# Altium project WS2812RGB_Project.PrjPcb
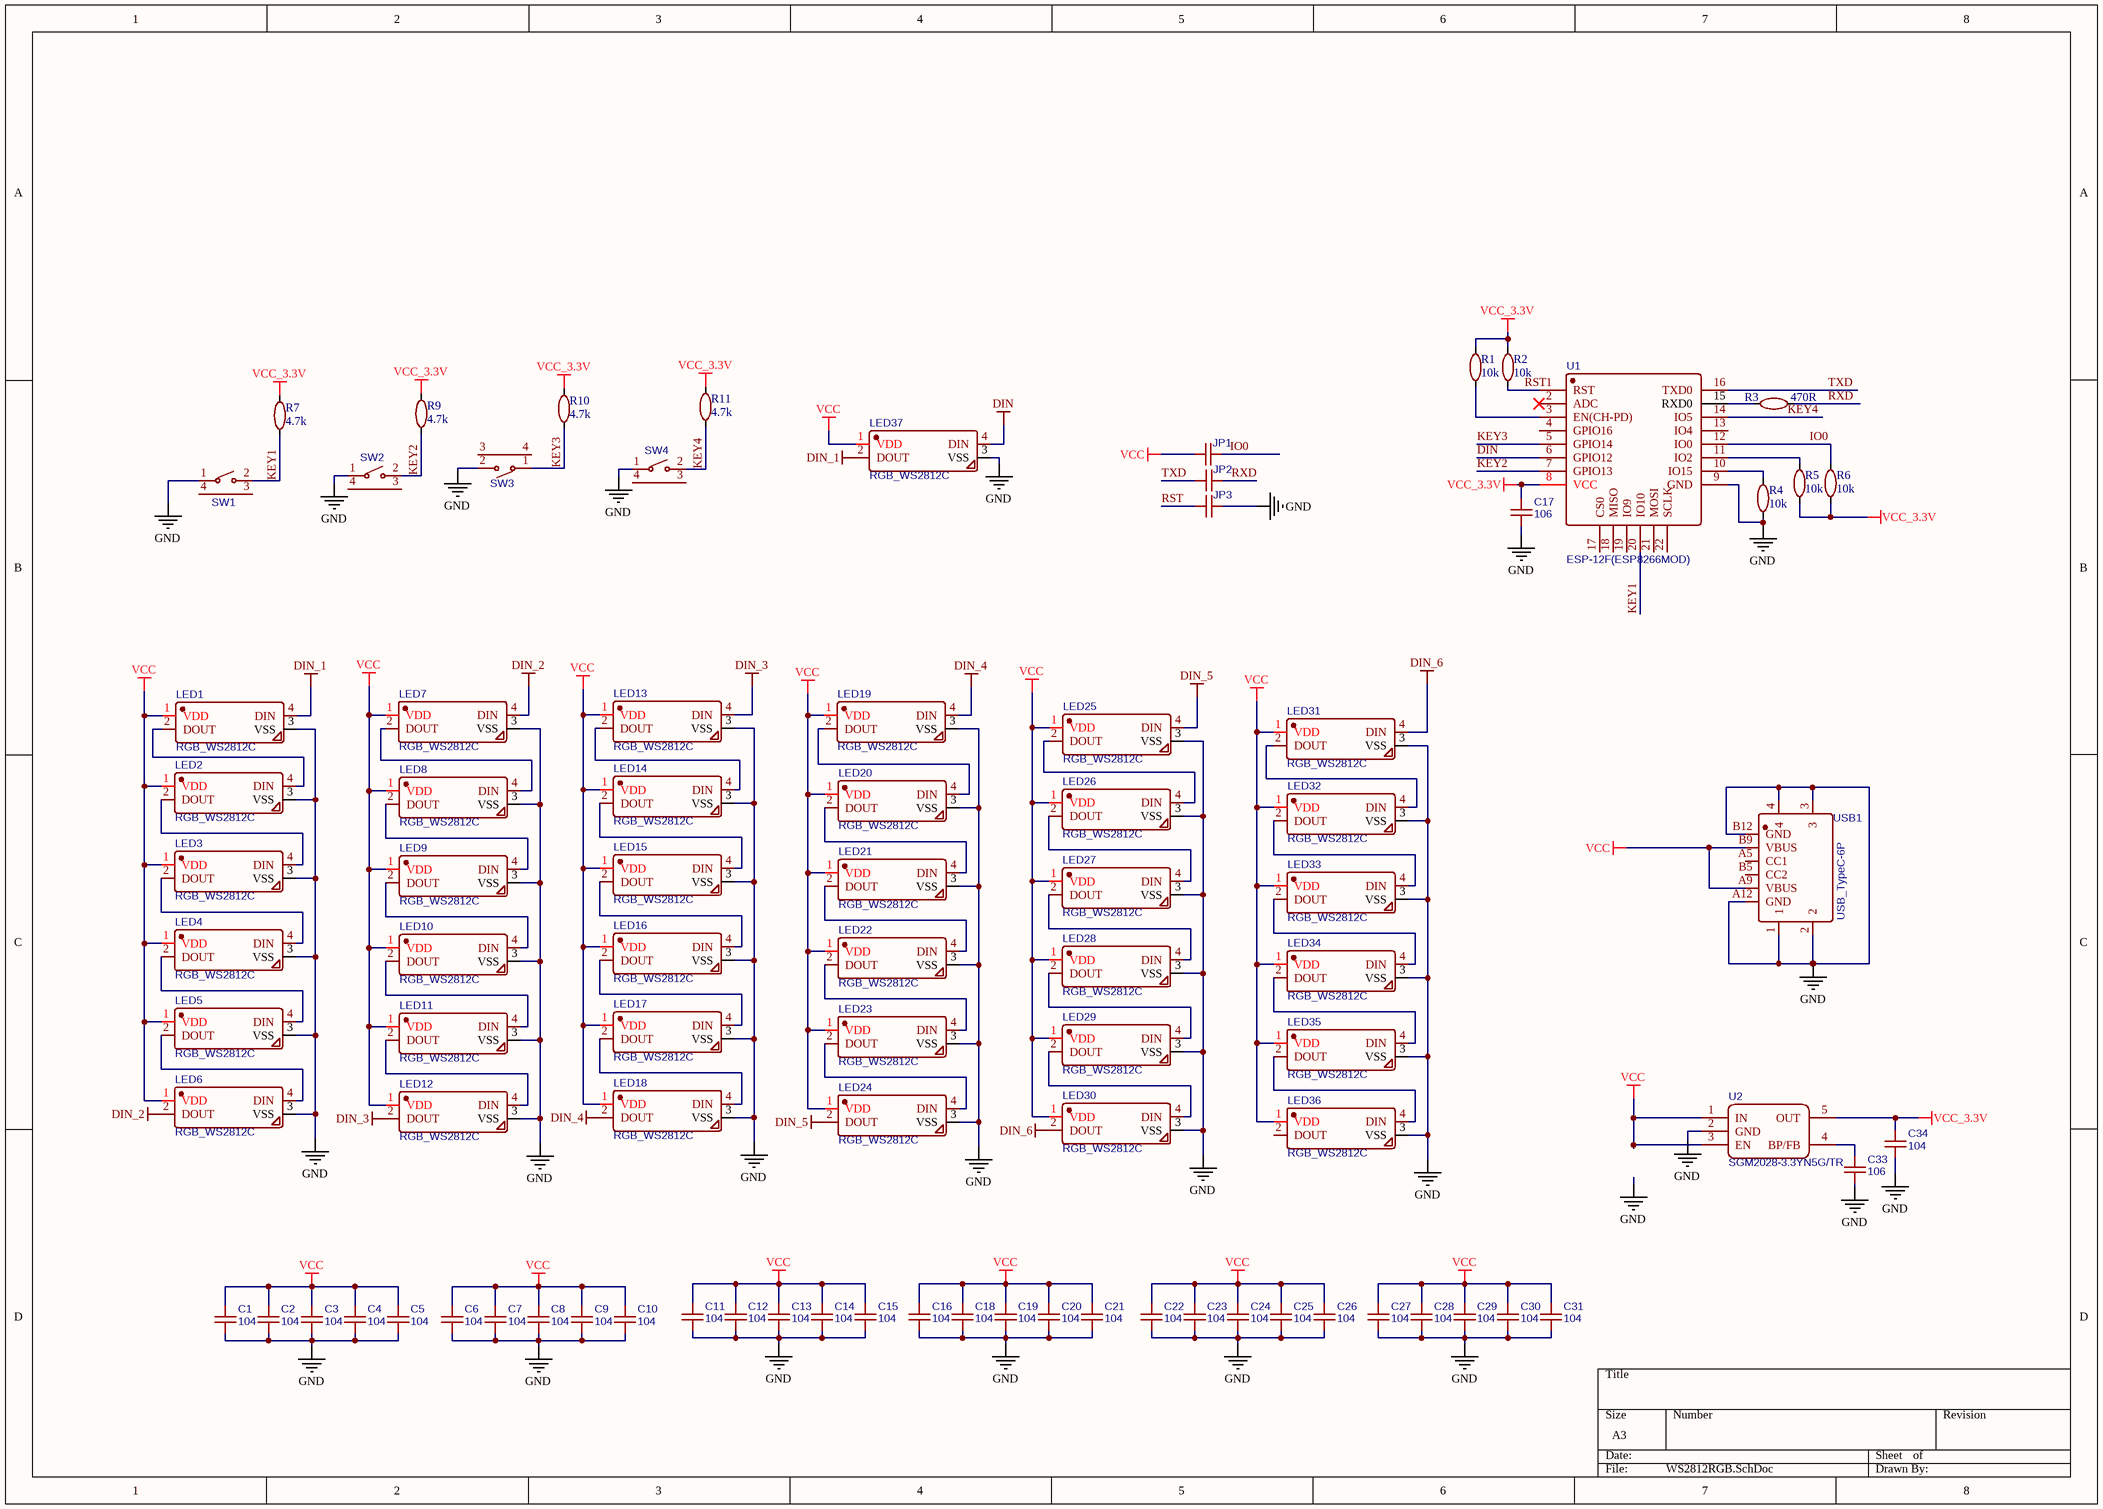
[diagram p0: WS2812RGB.SchDoc]
1 sheet, 90 parts. Net scope: global (net labels, ports and power ports of the same name join across sheets).
Board file: WS2812RGB_2.PcbDoc

## Sheet WS2812RGB.SchDoc
size A3

### Parts
C1  104  [CAP_0603]
C2  104  [CAP_0603]
C3  104  [CAP_0603]
C4  104  [CAP_0603]
C5  104  [CAP_0603]
C6  104  [CAP_0603]
C7  104  [CAP_0603]
C8  104  [CAP_0603]
C9  104  [CAP_0603]
C10  104  [CAP_0603]
C11  104  [CAP_0603]
C12  104  [CAP_0603]
C13  104  [CAP_0603]
C14  104  [CAP_0603]
C15  104  [CAP_0603]
C16  104  [CAP_0603]
C17  106  [CAP_0603]
C18  104  [CAP_0603]
C19  104  [CAP_0603]
C20  104  [CAP_0603]
C21  104  [CAP_0603]
C22  104  [CAP_0603]
C23  104  [CAP_0603]
C24  104  [CAP_0603]
C25  104  [CAP_0603]
C26  104  [CAP_0603]
C27  104  [CAP_0603]
C28  104  [CAP_0603]
C29  104  [CAP_0603]
C30  104  [CAP_0603]
C31  104  [CAP_0603]
C33  106  [CAP_0603]
C34  104  [CAP_0603]
JP1  104  [CAP_0805]  (value not drawn)
JP2  104  [CAP_0805]  (value not drawn)
JP3  104  [CAP_0805]  (value not drawn)
LED1  RGB_WS2812C  [LED_5050-SMD_4P-WS2812]
LED2  RGB_WS2812C  [LED_5050-SMD_4P-WS2812]
LED3  RGB_WS2812C  [LED_5050-SMD_4P-WS2812]
LED4  RGB_WS2812C  [LED_5050-SMD_4P-WS2812]
LED5  RGB_WS2812C  [LED_5050-SMD_4P-WS2812]
LED6  RGB_WS2812C  [LED_5050-SMD_4P-WS2812]
LED7  RGB_WS2812C  [LED_5050-SMD_4P-WS2812]
LED8  RGB_WS2812C  [LED_5050-SMD_4P-WS2812]
LED9  RGB_WS2812C  [LED_5050-SMD_4P-WS2812]
LED10  RGB_WS2812C  [LED_5050-SMD_4P-WS2812]
LED11  RGB_WS2812C  [LED_5050-SMD_4P-WS2812]
LED12  RGB_WS2812C  [LED_5050-SMD_4P-WS2812]
LED13  RGB_WS2812C  [LED_5050-SMD_4P-WS2812]
LED14  RGB_WS2812C  [LED_5050-SMD_4P-WS2812]
LED15  RGB_WS2812C  [LED_5050-SMD_4P-WS2812]
LED16  RGB_WS2812C  [LED_5050-SMD_4P-WS2812]
LED17  RGB_WS2812C  [LED_5050-SMD_4P-WS2812]
LED18  RGB_WS2812C  [LED_5050-SMD_4P-WS2812]
LED19  RGB_WS2812C  [LED_5050-SMD_4P-WS2812]
LED20  RGB_WS2812C  [LED_5050-SMD_4P-WS2812]
LED21  RGB_WS2812C  [LED_5050-SMD_4P-WS2812]
LED22  RGB_WS2812C  [LED_5050-SMD_4P-WS2812]
LED23  RGB_WS2812C  [LED_5050-SMD_4P-WS2812]
LED24  RGB_WS2812C  [LED_5050-SMD_4P-WS2812]
LED25  RGB_WS2812C  [LED_5050-SMD_4P-WS2812]
LED26  RGB_WS2812C  [LED_5050-SMD_4P-WS2812]
LED27  RGB_WS2812C  [LED_5050-SMD_4P-WS2812]
LED28  RGB_WS2812C  [LED_5050-SMD_4P-WS2812]
LED29  RGB_WS2812C  [LED_5050-SMD_4P-WS2812]
LED30  RGB_WS2812C  [LED_5050-SMD_4P-WS2812]
LED31  RGB_WS2812C  [LED_5050-SMD_4P-WS2812]
LED32  RGB_WS2812C  [LED_5050-SMD_4P-WS2812]
LED33  RGB_WS2812C  [LED_5050-SMD_4P-WS2812]
LED34  RGB_WS2812C  [LED_5050-SMD_4P-WS2812]
LED35  RGB_WS2812C  [LED_5050-SMD_4P-WS2812]
LED36  RGB_WS2812C  [LED_5050-SMD_4P-WS2812]
LED37  RGB_WS2812C  [LED_5050-SMD_4P-WS2812]
R1  10k  [RES_0402]
R2  10k  [RES_0402]
R3  470R  [RES_0402]
R4  10k  [RES_0402]
R5  10k  [RES_0402]
R6  10k  [RES_0402]
R7  4.7k  [RES_0402]
R9  4.7k  [RES_0402]
R10  4.7k  [RES_0402]
R11  4.7k  [RES_0402]
SW1  TS-1086E-16  [SW-SMD_TS-1086E-16]  (value not drawn)
SW2  TS-1086E-16  [SW-SMD_TS-1086E-16]  (value not drawn)
SW3  TS-1086E-16  [SW-SMD_TS-1086E-16]  (value not drawn)
SW4  TS-1086E-16  [SW-SMD_TS-1086E-16]  (value not drawn)
U1  ESP-12F(ESP8266MOD)  [WIFIM-SMD_ESP-12F-ESP8266MOD]
U2  SGM2028-3.3YN5G/TR  [SOT23_5]
USB1  USB_TypeC-6P  [USB-TYPE-C-SMD]

### Nets
DIN: LED37.4(DIN) U1.6(GPIO12)
DIN_1: LED1.4(DIN) LED37.2(DOUT)
DIN_2: LED6.2(DOUT) LED7.4(DIN)
DIN_3: LED12.2(DOUT) LED13.4(DIN)
DIN_4: LED18.2(DOUT) LED19.4(DIN)
DIN_5: LED24.2(DOUT) LED25.4(DIN)
DIN_6: LED30.2(DOUT) LED31.4(DIN)
GND: C1.2 C2.2 C3.2 C4.2 C5.2 C6.2 C7.2 C8.2 C9.2 C10.2 C11.2 C12.2 C13.2 C14.2 C15.2 C16.2 C17.2 C18.2 C19.2 C20.2 C21.2 C22.2 C23.2 C24.2 C25.2 C26.2 C27.2 C28.2 C29.2 C30.2 C31.2 C33.2 C34.2 JP3.2 LED1.3(VSS) LED2.3(VSS) LED3.3(VSS) LED4.3(VSS) LED5.3(VSS) LED6.3(VSS) LED7.3(VSS) LED8.3(VSS) LED9.3(VSS) LED10.3(VSS) LED11.3(VSS) LED12.3(VSS) LED13.3(VSS) LED14.3(VSS) LED15.3(VSS) LED16.3(VSS) LED17.3(VSS) LED18.3(VSS) LED19.3(VSS) LED20.3(VSS) LED21.3(VSS) LED22.3(VSS) LED23.3(VSS) LED24.3(VSS) LED25.3(VSS) LED26.3(VSS) LED27.3(VSS) LED28.3(VSS) LED29.3(VSS) LED30.3(VSS) LED31.3(VSS) LED32.3(VSS) LED33.3(VSS) LED34.3(VSS) LED35.3(VSS) LED36.3(VSS) LED37.3(VSS) R4.2 SW1.1 SW2.1 SW3.2 SW4.1 U1.9(GND) U2.2(GND) USB1.1 USB1.2 USB1.3 USB1.4 USB1.A12(GND) USB1.B12(GND)
VCC: C1.1 C2.1 C3.1 C4.1 C5.1 C6.1 C7.1 C8.1 C9.1 C10.1 C11.1 C12.1 C13.1 C14.1 C15.1 C16.1 C18.1 C19.1 C20.1 C21.1 C22.1 C23.1 C24.1 C25.1 C26.1 C27.1 C28.1 C29.1 C30.1 C31.1 JP1.1 LED1.1(VDD) LED2.1(VDD) LED3.1(VDD) LED4.1(VDD) LED5.1(VDD) LED6.1(VDD) LED7.1(VDD) LED8.1(VDD) LED9.1(VDD) LED10.1(VDD) LED11.1(VDD) LED12.1(VDD) LED13.1(VDD) LED14.1(VDD) LED15.1(VDD) LED16.1(VDD) LED17.1(VDD) LED18.1(VDD) LED19.1(VDD) LED20.1(VDD) LED21.1(VDD) LED22.1(VDD) LED23.1(VDD) LED24.1(VDD) LED25.1(VDD) LED26.1(VDD) LED27.1(VDD) LED28.1(VDD) LED29.1(VDD) LED30.1(VDD) LED31.1(VDD) LED32.1(VDD) LED33.1(VDD) LED34.1(VDD) LED35.1(VDD) LED36.1(VDD) LED37.1(VDD) U2.1(IN) U2.3(EN) USB1.A9(VBUS) USB1.B9(VBUS)
VCC_3.3V: C17.1 C34.1 R1.1 R2.1 R5.2 R6.2 R7.1 R9.1 R10.1 R11.1 U1.8(VCC) U2.5(OUT)
IO0: JP1.2 R6.1 U1.12(IO0)
KEY1: R7.2 SW1.2 U1.20(IO10)
KEY2: R9.2 SW2.2 U1.7(GPIO13)
KEY3: R10.2 SW3.1 U1.5(GPIO14)
KEY4: R11.2 SW4.2 U1.14(IO5)
RST: JP3.1 R2.2 U1.1(RST)
RXD: JP2.2 R3.2
TXD: JP2.1 U1.16(TXD0)
NetC33_1: C33.1 U2.4(BP/FB)
NetLED1_2: LED1.2(DOUT) LED2.4(DIN)
NetLED2_2: LED2.2(DOUT) LED3.4(DIN)
NetLED3_2: LED3.2(DOUT) LED4.4(DIN)
NetLED4_2: LED4.2(DOUT) LED5.4(DIN)
NetLED5_2: LED5.2(DOUT) LED6.4(DIN)
NetLED7_2: LED7.2(DOUT) LED8.4(DIN)
NetLED8_2: LED8.2(DOUT) LED9.4(DIN)
NetLED9_2: LED9.2(DOUT) LED10.4(DIN)
NetLED10_2: LED10.2(DOUT) LED11.4(DIN)
NetLED11_2: LED11.2(DOUT) LED12.4(DIN)
NetLED13_2: LED13.2(DOUT) LED14.4(DIN)
NetLED14_2: LED14.2(DOUT) LED15.4(DIN)
NetLED15_2: LED15.2(DOUT) LED16.4(DIN)
NetLED16_2: LED16.2(DOUT) LED17.4(DIN)
NetLED17_2: LED17.2(DOUT) LED18.4(DIN)
NetLED19_2: LED19.2(DOUT) LED20.4(DIN)
NetLED20_2: LED20.2(DOUT) LED21.4(DIN)
NetLED21_2: LED21.2(DOUT) LED22.4(DIN)
NetLED22_2: LED22.2(DOUT) LED23.4(DIN)
NetLED23_2: LED23.2(DOUT) LED24.4(DIN)
NetLED25_2: LED25.2(DOUT) LED26.4(DIN)
NetLED26_2: LED26.2(DOUT) LED27.4(DIN)
NetLED27_2: LED27.2(DOUT) LED28.4(DIN)
NetLED28_2: LED28.2(DOUT) LED29.4(DIN)
NetLED29_2: LED29.2(DOUT) LED30.4(DIN)
NetLED31_2: LED31.2(DOUT) LED32.4(DIN)
NetLED32_2: LED32.2(DOUT) LED33.4(DIN)
NetLED33_2: LED33.2(DOUT) LED34.4(DIN)
NetLED34_2: LED34.2(DOUT) LED35.4(DIN)
NetLED35_2: LED35.2(DOUT) LED36.4(DIN)
NetR1_2: R1.2 U1.3(EN(CH-PD))
NetR3_1: R3.1 U1.15(RXD0)
NetR4_1: R4.1 U1.10(IO15)
NetR5_1: R5.1 U1.11(IO2)

Not connected (* = marked no-connect by the designer): LED36 2(DOUT); SW1 3 4; SW2 3 4; SW3 3 4; SW4 3 4; U1 2(ADC)* 4(GPIO16) 13(IO4) 17(CS0) 18(MISO) 19(IO9) 21(MOSI) 22(SCLK); USB1 A5(CC1) B5(CC2)

### Library data of the parts
C1-C31 C33 C34 = CAP_0603: BOM_Manufacturer: Samsung Electro-Mechanics; BOM_Manufacturer Part: CL10B104KB8WPNC; nameAlias: Capacitance; Contributor: LCSC; BOM_Supplier: LCSC; BOM_Supplier Part: C307348; spicePre: C; spiceSymbolName: CL10B104KB8WPNC
JP1-JP3 = CAP_0805: BOM_Manufacturer: Samsung Electro-Mechanics; BOM_Manufacturer Part: CL10B104KB8WPNC; nameAlias: Capacitance; Contributor: LCSC; BOM_Supplier: LCSC; BOM_Supplier Part: C307348; spicePre: C; spiceSymbolName: CL10B104KB8WPNC
LED1-LED37 = RGB_WS2812C: BOM_Manufacturer: Worldsemi; Contributor: LCSC; SMT Type: Extend; BOM_Supplier: LCSC; BOM_Manufacturer Part: WS2812C; BOM_Supplier Part: C114587; BOM_JLCPCB SMD: Yes; spicePre: L; spiceSymbolName: WS2812C
R1-R7 R9-R11 = RES_0402
SW1-SW4 = TS-1086E-16: BOM_Manufacturer: XUNPU; Contributor: LCSC; BOM_Supplier: LCSC; BOM_Supplier Part: C455276; BOM_Manufacturer Part: TS-1086E-16; spicePre: S; spiceSymbolName: TS-1086E-16
U1 = ESP-12F(ESP8266MOD): BOM_Manufacturer: Ai-Thinker; BOM_Supplier: LCSC; BOM_Manufacturer Part: ESP-12F(ESP8266MOD); BOM_Supplier Part: C82891; spicePre: U; spiceSymbolName: ESP-12F(ESP8266MOD)
U2 = SGM2028-3.3YN5G/TR: BOM_Manufacturer: SGMICRO; SMT Type: Extend; BOM_Supplier: LCSC; BOM_Manufacturer Part: SGM2028-3.3YN5G/TR; BOM_Supplier Part: C81088; BOM_JLCPCB SMD: Yes; spicePre: U; spiceSymbolName: SGM2028-3.3YN5G/TR
USB1 = USB_TypeC-6P: BOM_Manufacturer: Jing Extension of the Electronic Co.; BOM_Manufacturer Part: 918-418K2023S40006; Contributor: LCSC; BOM_Supplier: LCSC; BOM_Supplier Part: C399925; spicePre: U; spiceSymbolName: 918-418K2023S40006